# Altium schematic sheet My_STM32_BOARD_SCH.SchDoc
size A4
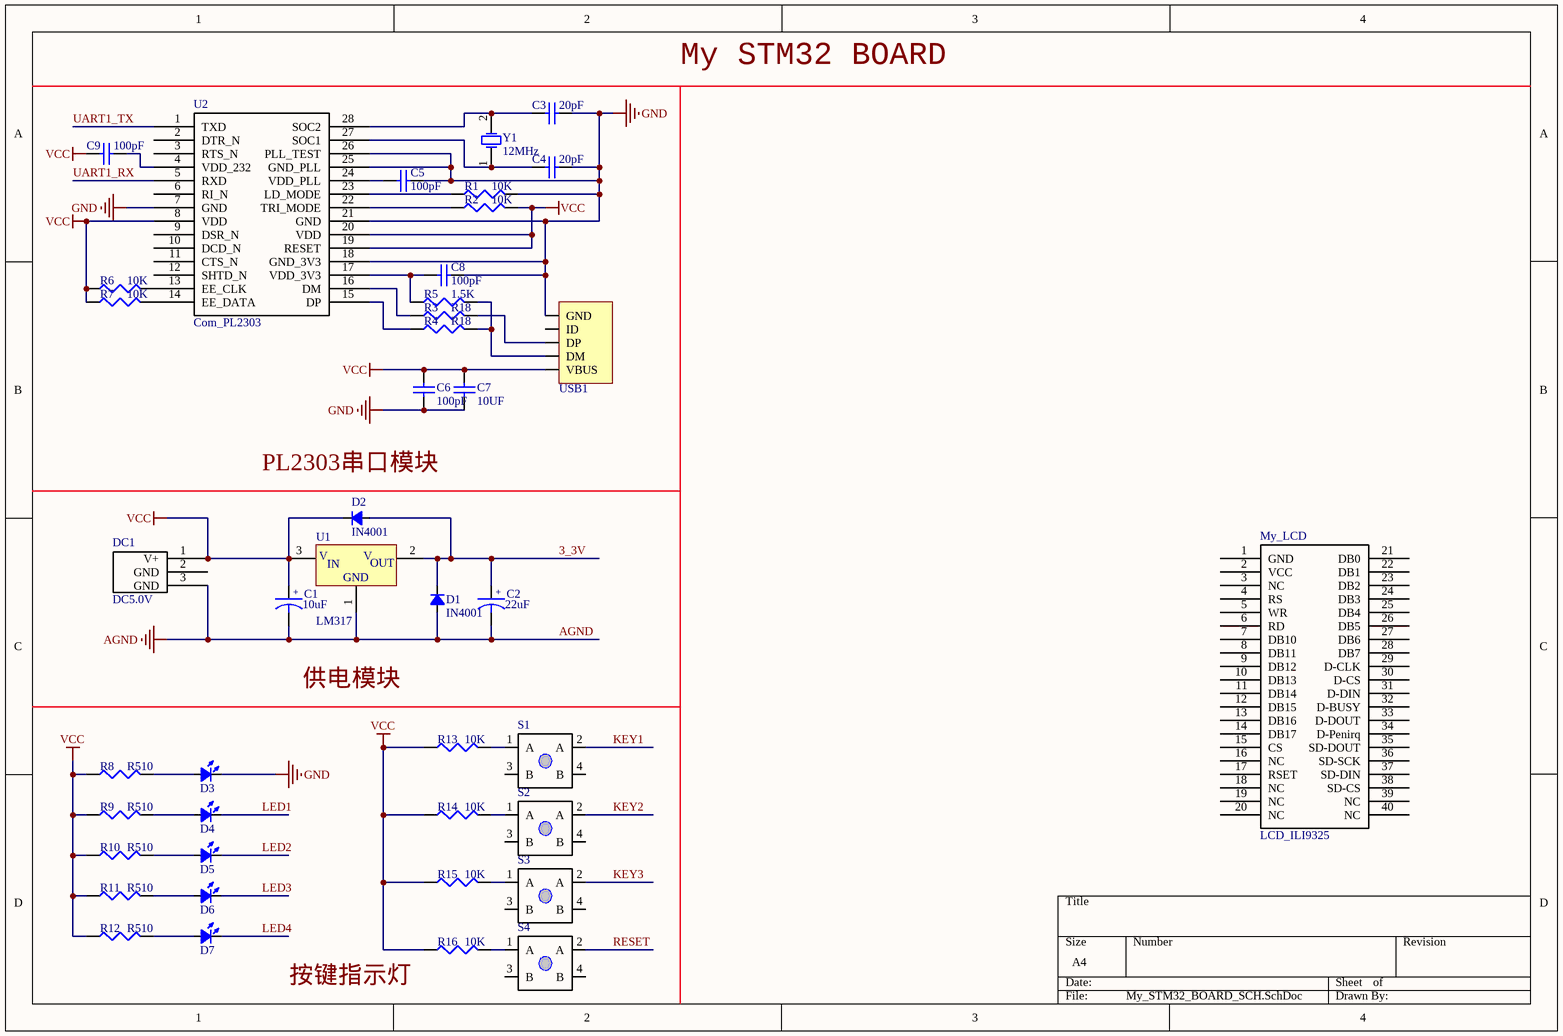
[diagram p0: My_STM32_BOARD_SCH.SchDoc]

## Parts
C1  Cap_Pol  [Cap_Pol_F5]  (value not drawn)
C2  value 22uF  [Cap_Pol_F6]  (hidden comment: Cap_Pol)
C3  value 20pF  [0402]  (hidden comment: Cap)
C4  value 20pF  [0402]  (hidden comment: Cap)
C5  value 100pF  [0402]  (hidden comment: Cap)
C6  value 100pF  [0402]  (hidden comment: Cap)
C7  value 10UF  [2029]  (hidden comment: Cap)
C8  value 100pF  [0402]  (hidden comment: Cap)
C9  value 100pF  [0402]  (hidden comment: Cap)
D1  value IN4001  [DIODE_DO-214AC]
D2  value IN4001  [DIODE_DO-214AC]
D3  LED_0805  [LED_0805_RED]  (value not drawn)
D4  LED_0805  [LED_1206_BLUE]  (value not drawn)
D5  LED_0805  [LED_1206_BLUE]  (value not drawn)
D6  LED_0805  [LED_1206_BLUE]  (value not drawn)
D7  LED_0805  [LED_1206_BLUE]  (value not drawn)
DC1  DC5.0V  [DC_5V]
My_LCD  LCD_ILI9325  [ILI9325]
R1  value 10K  [6-0805_N]  (hidden comment: Res3)
R2  value 10K  [6-0805_N]  (hidden comment: Res3)
R3  value R18  [6-0805_N]  (hidden comment: Res3)
R4  value R18  [6-0805_N]  (hidden comment: Res3)
R5  value 1.5K  [6-0805_N]  (hidden comment: Res3)
R6  value 10K  [6-0805_N]  (hidden comment: Res3)
R7  value 10K  [6-0805_N]  (hidden comment: Res3)
R8  value R510  [6-0805_N]  (hidden comment: Res3)
R9  value R510  [6-0805_N]  (hidden comment: Res3)
R10  value R510  [6-0805_N]  (hidden comment: Res3)
R11  value R510  [6-0805_N]  (hidden comment: Res3)
R12  value R510  [6-0805_N]  (hidden comment: Res3)
R13  value 10K  [6-0805_N]  (hidden comment: Res3)
R14  value 10K  [6-0805_N]  (hidden comment: Res3)
R15  value 10K  [6-0805_N]  (hidden comment: Res3)
R16  value 10K  [6-0805_N]  (hidden comment: Res3)
S1  Button  [My_Button]  (value not drawn)
S2  Button  [My_Button]  (value not drawn)
S3  Button  [My_Button]  (value not drawn)
S4  Button  [My_Button]  (value not drawn)
U1  LM317  [lm1117]
U2  Com_PL2303  [SSOP-28]
USB1  USB_Mini  [USB_MINI-B]  (value not drawn)
Y1  value 12MHz  [XT_XTAL]  (hidden comment: XTAL)

## Nets
AGND: C1.2 C2.2 D1.1(A) DC1.3(GND) U1.1(GND)
GND: C3.2 C4.2 C5.2 C6.1 C7.1 C8.2 D3.2(K) R1.2 U2.7(GND) U2.18(GND_3V3) U2.21(GND) U2.25(GND_PLL) U2.26(PLL_TEST) USB1.5(GND)
VCC: C1.1 C6.2 C7.2 C9.2 D2.2(K) DC1.1(V+) R2.2 R6.1 R7.1 R8.1 R9.1 R10.1 R11.1 R12.1 R13.1 R14.1 R15.1 R16.1 U1.3(VIN) U2.8(VDD) U2.19(RESET) U2.20(VDD) USB1.1(VBUS)
3_3V: C2.1 D1.2(K) D2.1(A) U1.2(VOUT)
KEY1: S1.2(A)
KEY2: S2.2(A)
KEY3: S3.2(A)
LED1: D4.2(K)
LED2: D5.2(K)
LED3: D6.2(K)
LED4: D7.2(K)
RESET: S4.2(A)
UART1_RX: U2.5(RXD)
UART1_TX: U2.1(TXD)
NetC3_1: C3.1 U2.28(SOC2) Y1.2
NetC4_1: C4.1 U2.27(SOC1) Y1.1
NetC5_1: C5.1 U2.24(VDD_PLL)
NetC8_1: C8.1 R5.1 U2.17(VDD_3V3)
NetC9_1: C9.1 U2.4(VDD_232)
NetD3_1: D3.1(A) R8.2
NetD4_1: D4.1(A) R9.2
NetD5_1: D5.1(A) R10.2
NetD6_1: D6.1(A) R11.2
NetD7_1: D7.1(A) R12.2
NetR1_1: R1.1 U2.23(LD_MODE)
NetR2_1: R2.1 U2.22(TRI_MODE)
NetR3_1: R3.1 U2.16(DM)
NetR3_2: R3.2 USB1.3(DP)
NetR4_1: R4.1 U2.15(DP)
NetR4_2: R4.2 R5.2 USB1.2(DM)
NetR6_2: R6.2 U2.13(EE_CLK)
NetR7_2: R7.2 U2.14(EE_DATA)
NetR13_2: R13.2 S1.1(A)
NetR14_2: R14.2 S2.1(A)
NetR15_2: R15.2 S3.1(A)
NetR16_2: R16.2 S4.1(A)

Not connected (* = marked no-connect by the designer): DC1 2(GND); My_LCD 1(GND) 2(VCC) 3(NC) 4(RS) 5(WR) 6(RD) 7(DB10) 8(DB11) 9(DB12) 10(DB13) 11(DB14) 12(DB15) 13(DB16) 14(DB17) 15(CS) 16(NC) 17(RSET) 18(NC) 19(NC) 20(NC) 21(DB0) 22(DB1) 23(DB2) 24(DB3) 25(DB4) 26(DB5) 27(DB6) 28(DB7) 29(D-CLK) 30(D-CS) 31(D-DIN) 32(D-BUSY) 33(D-DOUT) 34(D-Penirq) 35(SD-DOUT) 36(SD-SCK) 37(SD-DIN) 38(SD-CS) 39(NC) 40(NC); S1 3(B) 4(B); S2 3(B) 4(B); S3 3(B) 4(B); S4 3(B) 4(B); U2 2(DTR_N) 3(RTS_N) 6(RI_N) 9(DSR_N) 10(DCD_N) 11(CTS_N) 12(SHTD_N); USB1 4(ID)

## Notes on the sheet
- My STM32 BOARD
- (near D2) PL2303串口模块
- 供电模块
- 按键指示灯
- (in symbol Cap_Pol) +; 10uF
- (in symbol Power_LM) V; IN; OUT

## Library data of the parts
C1 C2 = Cap_Pol: Capacitor
C3-C9 = Cap: Capacitor; Published: 8-Jun-2000; LatestRevisionDate: 17-Jul-2002; LatestRevisionNote: Re-released for DXP Platform.; PackageReference: RAD-0.3; Publisher: Altium Limited; PackageDescription: Radial Cap, Thru-Hole; 2 Leads; 0.3 in Pin Spacing
D1 D2 = Diode_SMA: Diode
D3-D7 = LED_0805: LED
DC1 = DC5V
My_LCD = LCD_ILI9325: LCD ILI9325
R1-R16 = Res3: Resistor; Published: 8-Jun-2000; LatestRevisionDate: 29-May-2009; LatestRevisionNote: IPC-7351 Footprint Added.; PackageReference: J1-0603; Publisher: Altium Limited; PackageDescription: Chip Resistor
S1-S4 = KEY_K4: 四脚按键
U1 = Power_LM: LM317 电源芯片
U2 = Com_PL2303: PL2303
USB1 = USB_Mini: USB